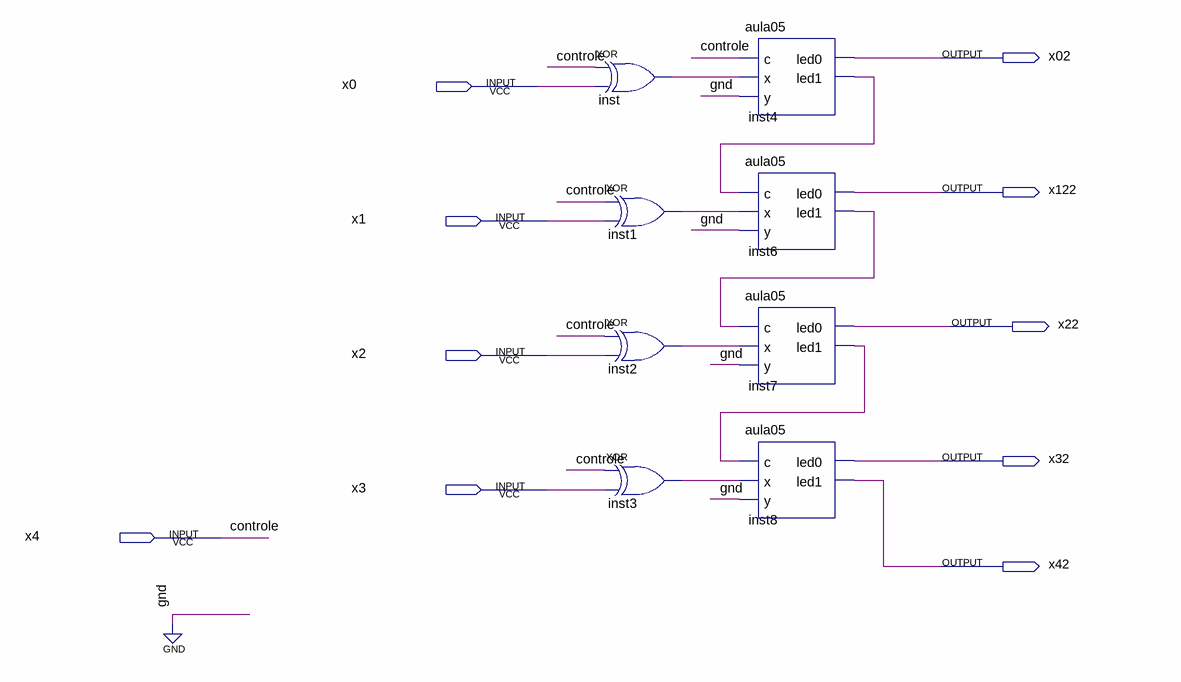
[diagram p0: schematic sheet]
// Quartus schematic comp2.bdf as structural Verilog: 8 symbols, 10 pins
module comp2 (
  input  x0,
  input  x1,
  input  x2,
  input  x3,
  input  x4,
  output x02,
  output x122,
  output x22,
  output x32,
  output x42
);

  wire inst1_out, inst2_out, inst3_out, inst4_led1, inst6_led1, inst7_led1, inst_out;

  xor inst (inst_out, x4, x0);
  xor inst1 (inst1_out, x4, x1);
  xor inst2 (inst2_out, x4, x2);
  xor inst3 (inst3_out, x4, x3);
  aula05 inst4 (.c(x4), .x(inst_out), .y(1'b0), .led0(x02), .led1(inst4_led1));
  aula05 inst6 (.c(inst4_led1), .x(inst1_out), .y(1'b0), .led0(x122), .led1(inst6_led1));
  aula05 inst7 (.c(inst6_led1), .x(inst2_out), .y(1'b0), .led0(x22), .led1(inst7_led1));
  aula05 inst8 (.c(inst7_led1), .x(inst3_out), .y(1'b0), .led0(x32), .led1(x42));

  // Other names for the same wires on the sheet: controle = x4
endmodule
